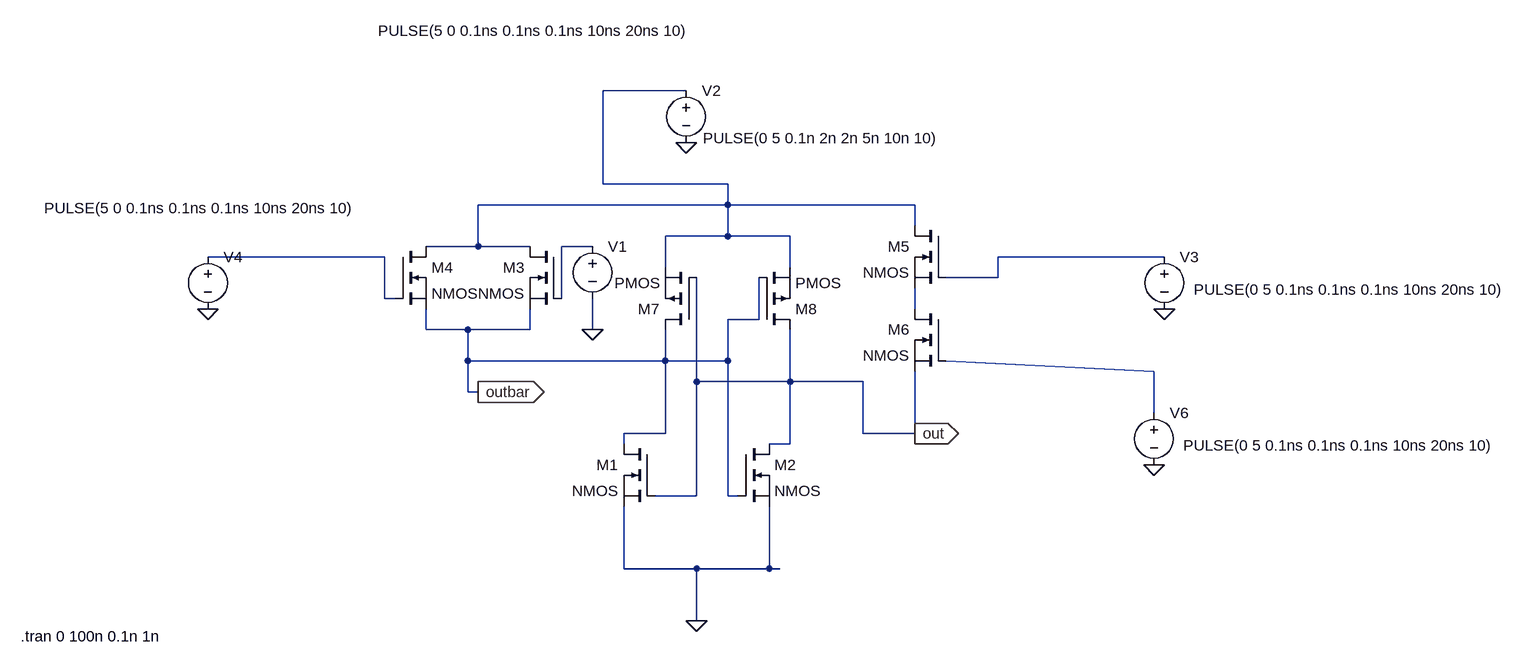
[diagram p0: schematic pfal nand.asc]
pfal nand.asc, the LTspice schematic file:
Version 4
SHEET 1 1656 696
WIRE 208 -160 80 -160
WIRE 80 -16 80 -160
WIRE 272 -16 80 -16
WIRE 272 16 272 -16
WIRE 272 16 -112 16
WIRE 560 16 272 16
WIRE 560 48 560 16
WIRE 272 64 272 16
WIRE 272 64 176 64
WIRE 368 64 272 64
WIRE -112 80 -112 16
WIRE -112 80 -192 80
WIRE -32 80 -112 80
WIRE 64 80 16 80
WIRE -256 96 -528 96
WIRE 944 96 688 96
WIRE 176 112 176 64
WIRE 368 112 368 64
WIRE 688 128 688 96
WIRE 688 128 608 128
WIRE -256 160 -256 96
WIRE -240 160 -256 160
WIRE 16 160 16 80
WIRE 560 176 560 144
WIRE 320 192 320 128
WIRE 320 192 272 192
WIRE -192 208 -192 176
WIRE -128 208 -192 208
WIRE -32 208 -32 176
WIRE -32 208 -128 208
WIRE 64 208 64 160
WIRE -128 256 -128 208
WIRE 176 256 176 208
WIRE 176 256 -128 256
WIRE 272 256 272 192
WIRE 272 256 176 256
WIRE 928 272 608 256
WIRE 224 288 224 128
WIRE 368 288 368 208
WIRE 368 288 224 288
WIRE 480 288 368 288
WIRE -128 304 -128 256
WIRE -112 304 -128 304
WIRE 928 336 928 272
WIRE 176 368 176 256
WIRE 176 368 112 368
WIRE 480 368 480 288
WIRE 560 368 560 272
WIRE 560 368 480 368
WIRE 112 384 112 368
WIRE 368 384 368 288
WIRE 368 384 336 384
WIRE 224 464 224 288
WIRE 224 464 160 464
WIRE 272 464 272 256
WIRE 288 464 272 464
WIRE 112 576 112 480
WIRE 224 576 112 576
WIRE 336 576 336 480
WIRE 336 576 224 576
WIRE 352 576 336 576
WIRE 224 656 224 576
FLAG 224 656 0
FLAG 208 -80 0
FLAG 944 176 0
FLAG 928 416 0
FLAG -528 176 0
FLAG 64 208 0
FLAG 560 368 out
IOPIN 560 368 Out
FLAG -112 304 outbar
IOPIN -112 304 Out
SYMBOL nmos 16 80 M0
SYMATTR InstName M3
SYMBOL nmos -240 80 R0
SYMATTR InstName M4
SYMBOL nmos 608 48 M0
SYMATTR InstName M5
SYMBOL nmos 608 176 M0
SYMATTR InstName M6
SYMBOL nmos 160 384 M0
SYMATTR InstName M1
SYMBOL nmos 288 384 R0
SYMATTR InstName M2
SYMBOL pmos 224 208 R180
SYMATTR InstName M7
SYMBOL pmos 320 208 M180
SYMATTR InstName M8
SYMBOL voltage 208 -176 R0
WINDOW 3 26 89 Left 2
WINDOW 123 0 0 Left 0
WINDOW 39 0 0 Left 0
SYMATTR Value PULSE(0 5 0.1n 2n 2n 5n 10n 10)
SYMATTR InstName V2
SYMBOL voltage 944 80 R0
WINDOW 3 45 66 Left 2
WINDOW 123 0 0 Left 0
WINDOW 39 0 0 Left 0
SYMATTR Value PULSE(0 5 0.1ns 0.1ns 0.1ns 10ns 20ns 10)
SYMATTR InstName V3
SYMBOL voltage 928 320 R0
WINDOW 3 45 66 Left 2
WINDOW 123 0 0 Left 0
WINDOW 39 0 0 Left 0
SYMATTR Value PULSE(0 5 0.1ns 0.1ns 0.1ns 10ns 20ns 10)
SYMATTR InstName V6
SYMBOL voltage 64 64 R0
WINDOW 3 -330 -316 Left 2
WINDOW 123 0 0 Left 0
WINDOW 39 0 0 Left 0
SYMATTR Value PULSE(5 0 0.1ns 0.1ns 0.1ns 10ns 20ns 10)
SYMATTR InstName V1
SYMBOL voltage -528 80 R0
WINDOW 3 -252 -59 Left 2
WINDOW 123 0 0 Left 0
WINDOW 39 0 0 Left 0
SYMATTR Value PULSE(5 0 0.1ns 0.1ns 0.1ns 10ns 20ns 10)
SYMATTR InstName V4
TEXT -816 680 Left 2 !.tran 0 100n 0.1n 1n

The netlist it stands for:
* pfal nand.asc
M3 N001 N002 outbar outbar NMOS
M4 N001 N003 outbar outbar NMOS
M5 N001 N004 N005 N005 NMOS
M6 N005 N006 out out NMOS
M1 outbar out 0 0 NMOS
M2 out outbar 0 0 NMOS
M7 outbar out N001 N001 PMOS
M8 out outbar N001 N001 PMOS
V2 N001 0 PULSE(0 5 0.1n 2n 2n 5n 10n 10)
V3 N004 0 PULSE(0 5 0.1ns 0.1ns 0.1ns 10ns 20ns 10)
V6 N006 0 PULSE(0 5 0.1ns 0.1ns 0.1ns 10ns 20ns 10)
V1 N002 0 PULSE(5 0 0.1ns 0.1ns 0.1ns 10ns 20ns 10)
V4 N003 0 PULSE(5 0 0.1ns 0.1ns 0.1ns 10ns 20ns 10)
.model NMOS NMOS
.model PMOS PMOS
.lib standard.mos
.tran 0 100n 0.1n 1n
.backanno
.end